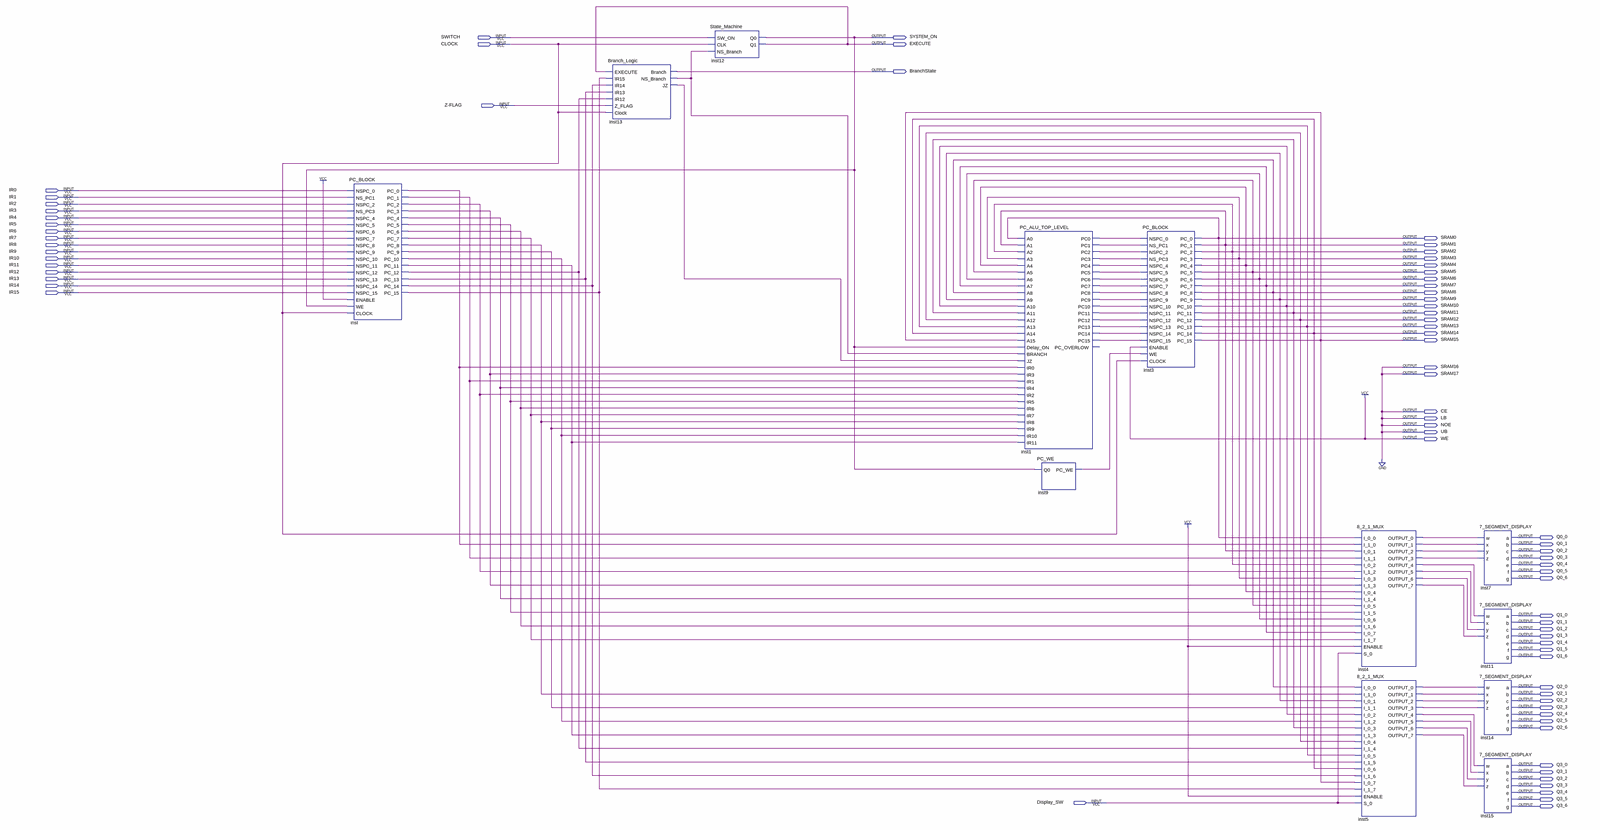
[diagram p0: schematic sheet, whole]
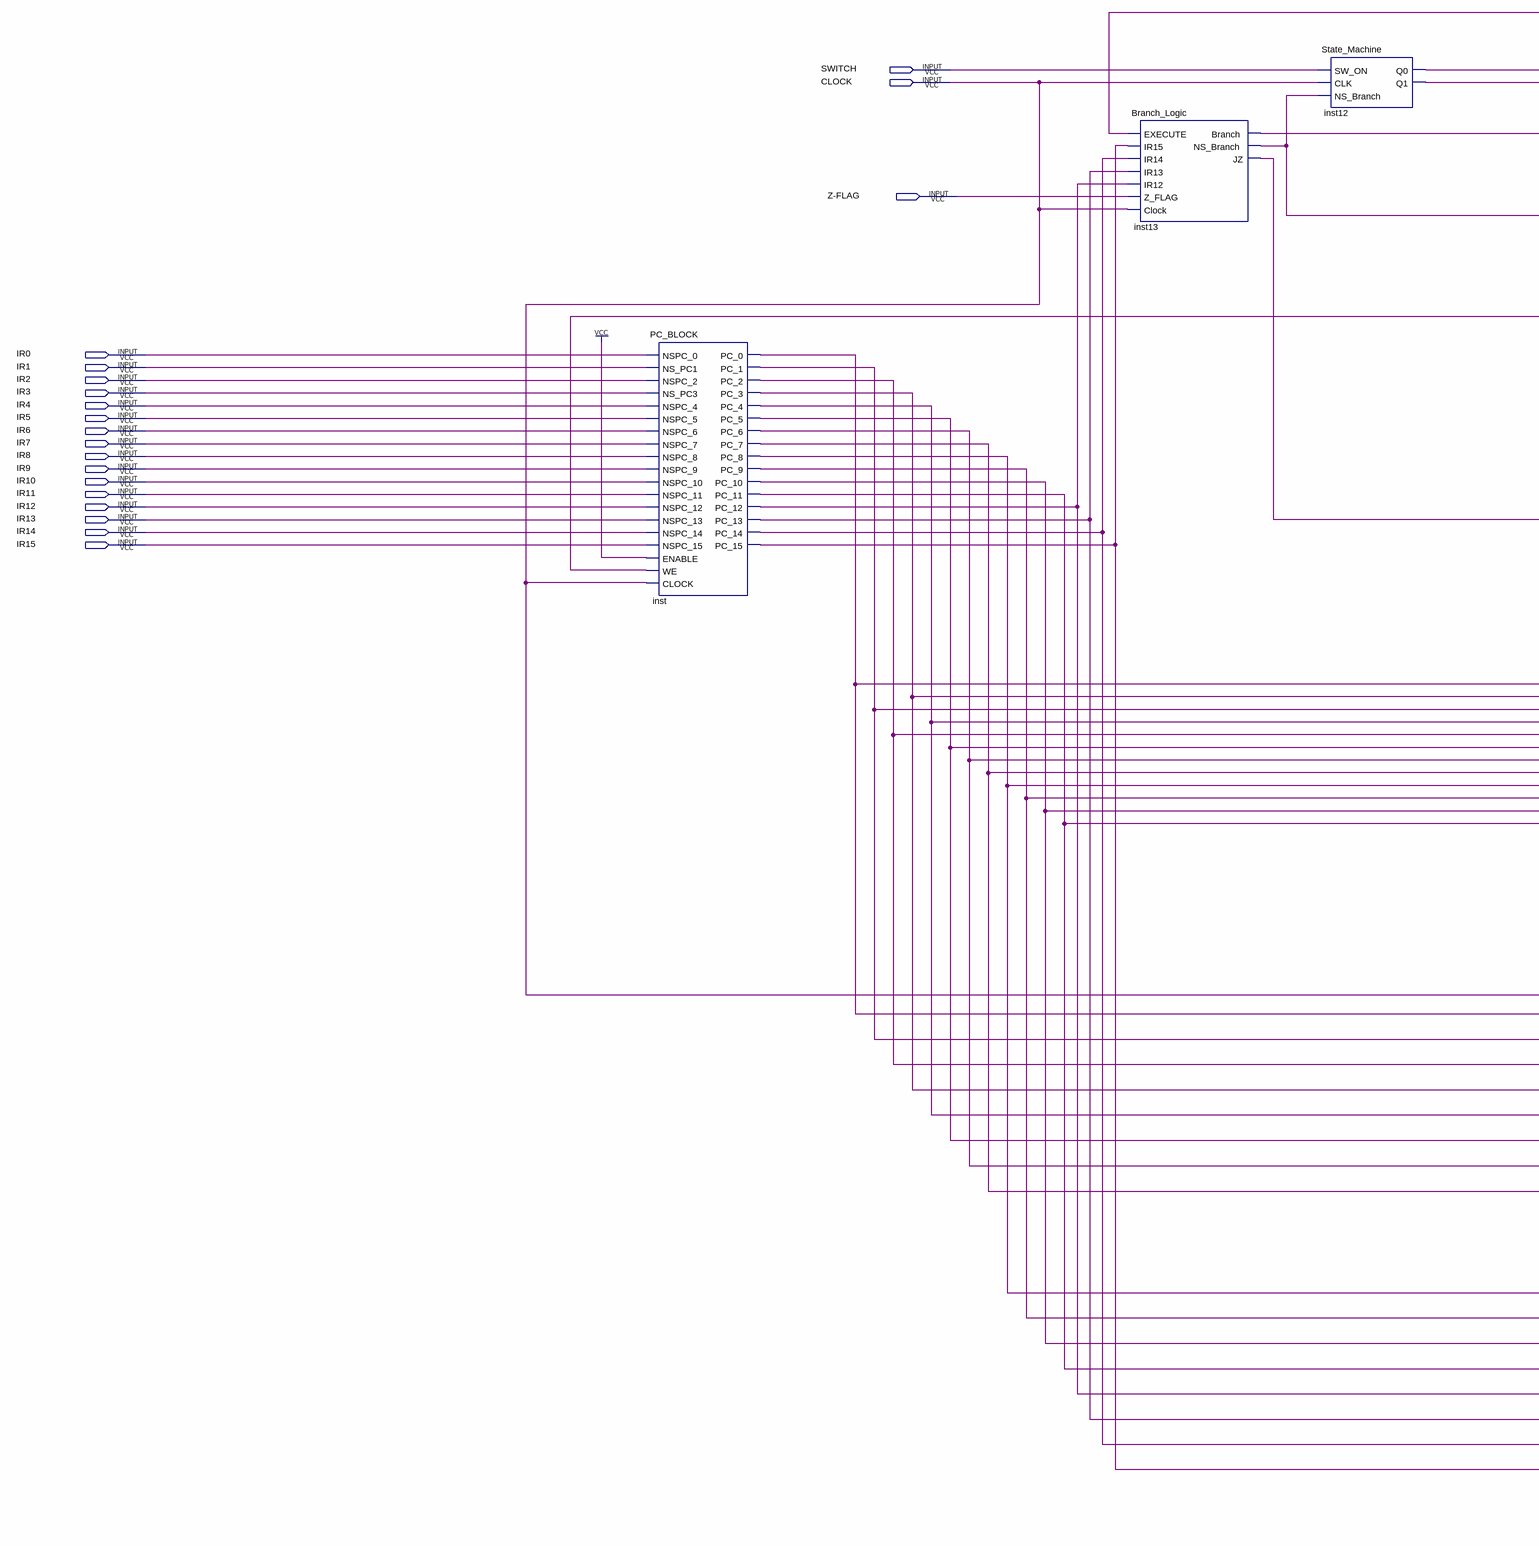
[diagram p1: schematic sheet, left part]
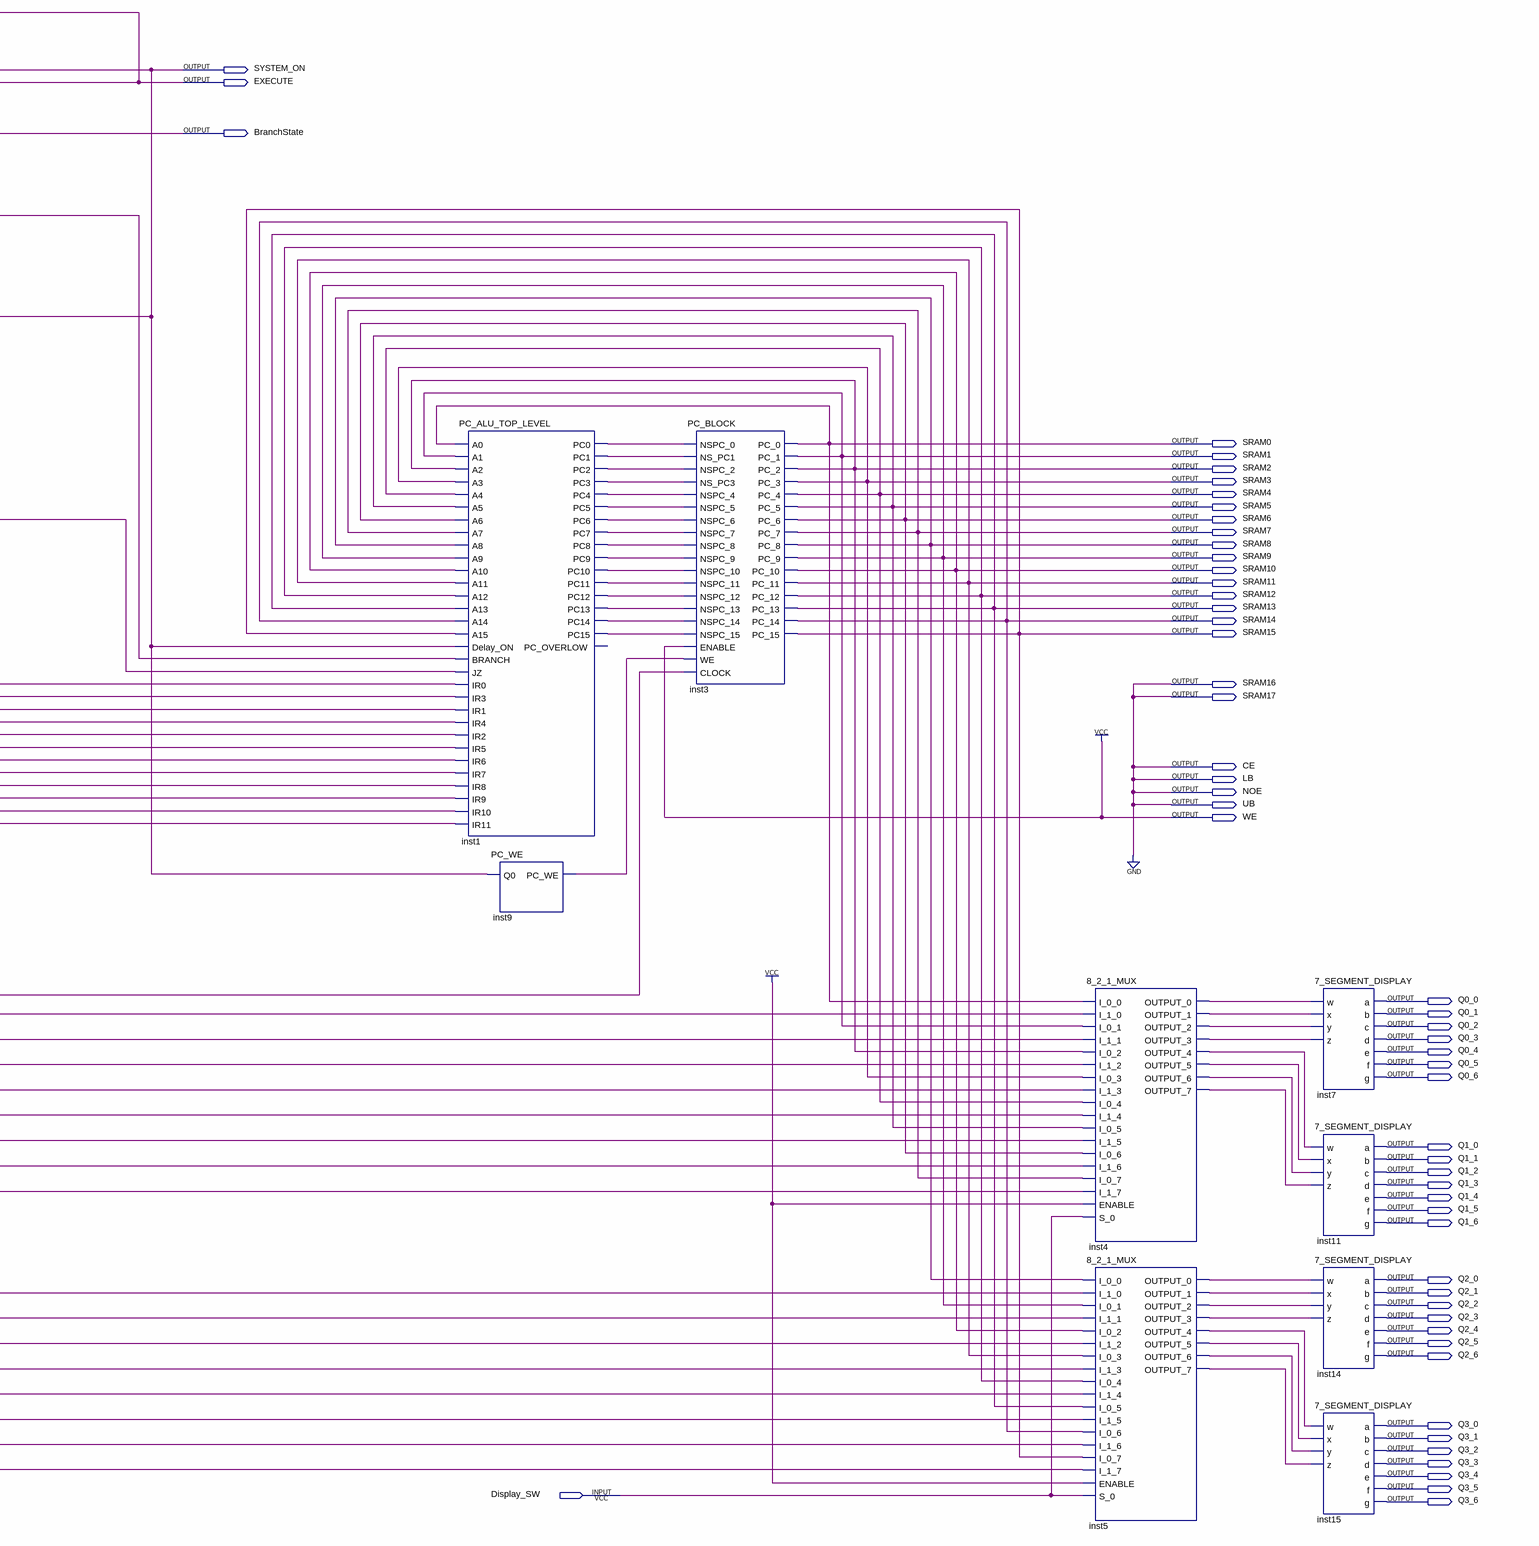
[diagram p2: schematic sheet, right part]
// Quartus schematic PC_TEST.bdf as structural Verilog: 12 symbols, 74 pins
module PC_TEST (
  input  SWITCH,
  input  CLOCK,
  input  \Z-FLAG ,
  input  IR0,
  input  IR1,
  input  IR2,
  input  IR3,
  input  IR4,
  input  IR5,
  input  IR6,
  input  IR7,
  input  IR8,
  input  IR9,
  input  IR10,
  input  IR11,
  input  IR12,
  input  IR13,
  input  IR14,
  input  IR15,
  input  Display_SW,
  output SYSTEM_ON,
  output EXECUTE,
  output BranchState,
  output SRAM0,
  output SRAM1,
  output SRAM2,
  output SRAM3,
  output SRAM4,
  output SRAM5,
  output SRAM6,
  output SRAM7,
  output SRAM8,
  output SRAM9,
  output SRAM10,
  output SRAM11,
  output SRAM12,
  output SRAM13,
  output SRAM14,
  output SRAM15,
  output SRAM16,
  output SRAM17,
  output CE,
  output LB,
  output NOE,
  output UB,
  output WE,
  output Q0_0,
  output Q0_1,
  output Q0_2,
  output Q0_3,
  output Q0_4,
  output Q0_5,
  output Q0_6,
  output Q1_0,
  output Q1_1,
  output Q1_2,
  output Q1_3,
  output Q1_4,
  output Q1_5,
  output Q1_6,
  output Q2_0,
  output Q2_1,
  output Q2_2,
  output Q2_3,
  output Q2_4,
  output Q2_5,
  output Q2_6,
  output Q3_0,
  output Q3_1,
  output Q3_2,
  output Q3_3,
  output Q3_4,
  output Q3_5,
  output Q3_6
);

  wire inst1_pc0, inst1_pc1, inst1_pc2, inst1_pc3, inst1_pc4, inst1_pc5, inst1_pc6, inst1_pc7, inst1_pc8,
       inst1_pc9, inst1_pc10, inst1_pc11, inst1_pc12, inst1_pc13, inst1_pc14, inst1_pc15, inst4_output_0,
       inst4_output_1, inst4_output_2, inst4_output_3, inst4_output_4, inst4_output_5, inst4_output_6,
       inst4_output_7, inst5_output_0, inst5_output_1, inst5_output_2, inst5_output_3, inst5_output_4,
       inst5_output_5, inst5_output_6, inst5_output_7, inst9_pc_we, inst13_jz, inst13_ns_branch, inst_pc_0,
       inst_pc_1, inst_pc_2, inst_pc_3, inst_pc_4, inst_pc_5, inst_pc_6, inst_pc_7, inst_pc_8, inst_pc_9,
       inst_pc_10, inst_pc_11, inst_pc_12, inst_pc_13, inst_pc_14, inst_pc_15;

  PC_BLOCK inst (
    .NSPC_0(IR0), .NS_PC1(IR1), .NSPC_2(IR2), .NS_PC3(IR3), .NSPC_4(IR4), .NSPC_5(IR5), .NSPC_6(IR6),
    .NSPC_7(IR7), .NSPC_8(IR8), .NSPC_9(IR9), .NSPC_10(IR10), .NSPC_11(IR11), .NSPC_12(IR12), .NSPC_13(IR13),
    .NSPC_14(IR14), .NSPC_15(IR15), .ENABLE(1'b1), .WE(SYSTEM_ON), .CLOCK(CLOCK), .PC_0(inst_pc_0),
    .PC_1(inst_pc_1), .PC_2(inst_pc_2), .PC_3(inst_pc_3), .PC_4(inst_pc_4), .PC_5(inst_pc_5),
    .PC_6(inst_pc_6), .PC_7(inst_pc_7), .PC_8(inst_pc_8), .PC_9(inst_pc_9), .PC_10(inst_pc_10),
    .PC_11(inst_pc_11), .PC_12(inst_pc_12), .PC_13(inst_pc_13), .PC_14(inst_pc_14), .PC_15(inst_pc_15));
  Branch_Logic inst13 (
    .EXECUTE(EXECUTE), .IR15(inst_pc_15), .IR14(inst_pc_14), .IR13(inst_pc_13), .IR12(inst_pc_12),
    .Z_FLAG(\Z-FLAG ), .Clock(CLOCK), .Branch(BranchState), .NS_Branch(inst13_ns_branch), .JZ(inst13_jz));
  State_Machine inst12 (.SW_ON(SWITCH), .CLK(CLOCK), .NS_Branch(inst13_ns_branch), .Q0(SYSTEM_ON), .Q1(EXECUTE));
  PC_ALU_TOP_LEVEL inst1 (
    .A0(SRAM0), .A1(SRAM1), .A2(SRAM2), .A3(SRAM3), .A4(SRAM4), .A5(SRAM5), .A6(SRAM6), .A7(SRAM7),
    .A8(SRAM8), .A9(SRAM9), .A10(SRAM10), .A11(SRAM11), .A12(SRAM12), .A13(SRAM13), .A14(SRAM14),
    .A15(SRAM15), .Delay_ON(SYSTEM_ON), .BRANCH(inst13_ns_branch), .JZ(inst13_jz), .IR0(inst_pc_0),
    .IR3(inst_pc_3), .IR1(inst_pc_1), .IR4(inst_pc_4), .IR2(inst_pc_2), .IR5(inst_pc_5), .IR6(inst_pc_6),
    .IR7(inst_pc_7), .IR8(inst_pc_8), .IR9(inst_pc_9), .IR10(inst_pc_10), .IR11(inst_pc_11), .PC0(inst1_pc0),
    .PC1(inst1_pc1), .PC2(inst1_pc2), .PC3(inst1_pc3), .PC4(inst1_pc4), .PC5(inst1_pc5), .PC6(inst1_pc6),
    .PC7(inst1_pc7), .PC8(inst1_pc8), .PC9(inst1_pc9), .PC10(inst1_pc10), .PC11(inst1_pc11),
    .PC12(inst1_pc12), .PC13(inst1_pc13), .PC14(inst1_pc14), .PC15(inst1_pc15));  // open: PC_OVERLOW
  PC_WE inst9 (.Q0(SYSTEM_ON), .PC_WE(inst9_pc_we));
  PC_BLOCK inst3 (
    .NSPC_0(inst1_pc0), .NS_PC1(inst1_pc1), .NSPC_2(inst1_pc2), .NS_PC3(inst1_pc3), .NSPC_4(inst1_pc4),
    .NSPC_5(inst1_pc5), .NSPC_6(inst1_pc6), .NSPC_7(inst1_pc7), .NSPC_8(inst1_pc8), .NSPC_9(inst1_pc9),
    .NSPC_10(inst1_pc10), .NSPC_11(inst1_pc11), .NSPC_12(inst1_pc12), .NSPC_13(inst1_pc13),
    .NSPC_14(inst1_pc14), .NSPC_15(inst1_pc15), .ENABLE(1'b1), .WE(inst9_pc_we), .CLOCK(CLOCK), .PC_0(SRAM0),
    .PC_1(SRAM1), .PC_2(SRAM2), .PC_3(SRAM3), .PC_4(SRAM4), .PC_5(SRAM5), .PC_6(SRAM6), .PC_7(SRAM7),
    .PC_8(SRAM8), .PC_9(SRAM9), .PC_10(SRAM10), .PC_11(SRAM11), .PC_12(SRAM12), .PC_13(SRAM13),
    .PC_14(SRAM14), .PC_15(SRAM15));
  \8_2_1_MUX  inst4 (
    .I_0_0(SRAM0), .I_1_0(inst_pc_0), .I_0_1(SRAM1), .I_1_1(inst_pc_1), .I_0_2(SRAM2), .I_1_2(inst_pc_2),
    .I_0_3(SRAM3), .I_1_3(inst_pc_3), .I_0_4(SRAM4), .I_1_4(inst_pc_4), .I_0_5(SRAM5), .I_1_5(inst_pc_5),
    .I_0_6(SRAM6), .I_1_6(inst_pc_6), .I_0_7(SRAM7), .I_1_7(inst_pc_7), .ENABLE(1'b1), .S_0(Display_SW),
    .OUTPUT_0(inst4_output_0), .OUTPUT_1(inst4_output_1), .OUTPUT_2(inst4_output_2),
    .OUTPUT_3(inst4_output_3), .OUTPUT_4(inst4_output_4), .OUTPUT_5(inst4_output_5),
    .OUTPUT_6(inst4_output_6), .OUTPUT_7(inst4_output_7));
  \8_2_1_MUX  inst5 (
    .I_0_0(SRAM8), .I_1_0(inst_pc_8), .I_0_1(SRAM9), .I_1_1(inst_pc_9), .I_0_2(SRAM10), .I_1_2(inst_pc_10),
    .I_0_3(SRAM11), .I_1_3(inst_pc_11), .I_0_4(SRAM12), .I_1_4(inst_pc_12), .I_0_5(SRAM13),
    .I_1_5(inst_pc_13), .I_0_6(SRAM14), .I_1_6(inst_pc_14), .I_0_7(SRAM15), .I_1_7(inst_pc_15),
    .ENABLE(1'b1), .S_0(Display_SW), .OUTPUT_0(inst5_output_0), .OUTPUT_1(inst5_output_1),
    .OUTPUT_2(inst5_output_2), .OUTPUT_3(inst5_output_3), .OUTPUT_4(inst5_output_4),
    .OUTPUT_5(inst5_output_5), .OUTPUT_6(inst5_output_6), .OUTPUT_7(inst5_output_7));
  \7_SEGMENT_DISPLAY  inst7 (
    .w(inst4_output_0), .x(inst4_output_1), .y(inst4_output_2), .z(inst4_output_3), .a(Q0_0), .b(Q0_1),
    .c(Q0_2), .d(Q0_3), .e(Q0_4), .f(Q0_5), .g(Q0_6));
  \7_SEGMENT_DISPLAY  inst11 (
    .w(inst4_output_4), .x(inst4_output_5), .y(inst4_output_6), .z(inst4_output_7), .a(Q1_0), .b(Q1_1),
    .c(Q1_2), .d(Q1_3), .e(Q1_4), .f(Q1_5), .g(Q1_6));
  \7_SEGMENT_DISPLAY  inst14 (
    .w(inst5_output_0), .x(inst5_output_1), .y(inst5_output_2), .z(inst5_output_3), .a(Q2_0), .b(Q2_1),
    .c(Q2_2), .d(Q2_3), .e(Q2_4), .f(Q2_5), .g(Q2_6));
  \7_SEGMENT_DISPLAY  inst15 (
    .w(inst5_output_4), .x(inst5_output_5), .y(inst5_output_6), .z(inst5_output_7), .a(Q3_0), .b(Q3_1),
    .c(Q3_2), .d(Q3_3), .e(Q3_4), .f(Q3_5), .g(Q3_6));

  assign CE = 1'b0;
  assign LB = 1'b0;
  assign NOE = 1'b0;
  assign SRAM16 = 1'b0;
  assign SRAM17 = 1'b0;
  assign UB = 1'b0;
  assign WE = 1'b1;
endmodule
